# Altium schematic sheet ConnectorsCircuit.SchDoc
size A4
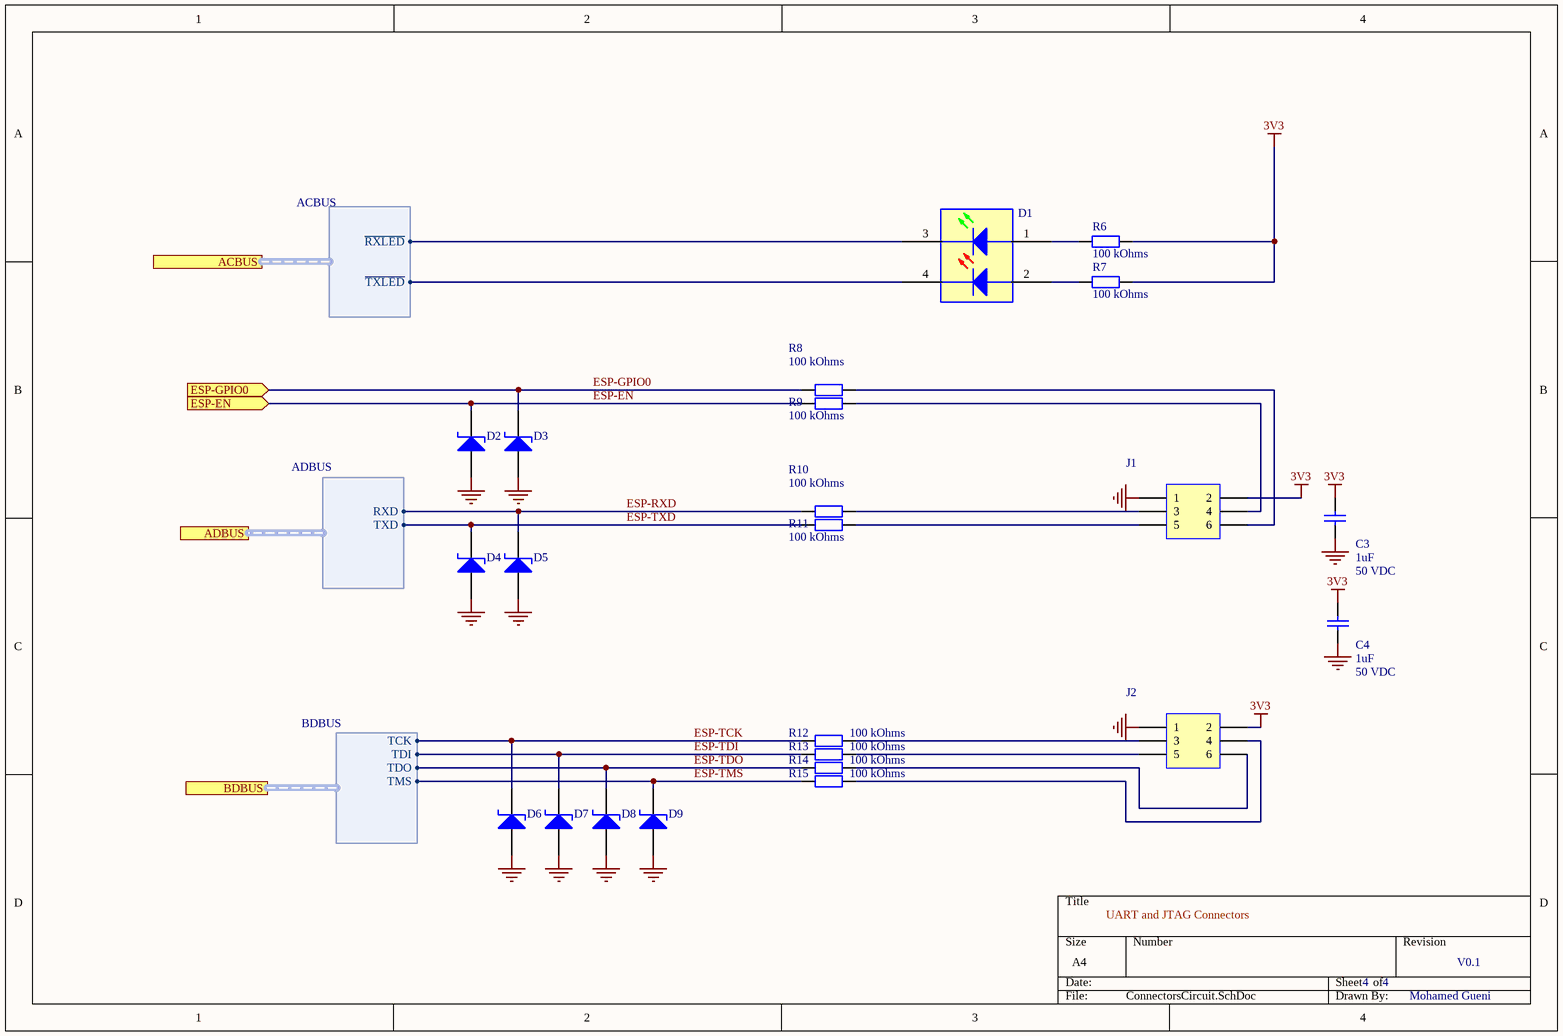
[diagram p0: ConnectorsCircuit.SchDoc]

## Parts
C3  Value 1: 1uF  Value 2: 50 VDC  [CAP-0603]  (hidden comment: Capacitor)
C4  Value 1: 1uF  Value 2: 50 VDC  [CAP-0603]  (hidden comment: Capacitor)
D1  LTST-C155KGJRKT  [LTSTC155KGJRKT]  (value not drawn)
D2  ESD7351HT1G  [SOD-323-2]  (value not drawn)
D3  ESD7351HT1G  [SOD-323-2]  (value not drawn)
D4  ESD7351HT1G  [SOD-323-2]  (value not drawn)
D5  ESD7351HT1G  [SOD-323-2]  (value not drawn)
D6  ESD7351HT1G  [SOD-323-2]  (value not drawn)
D7  ESD7351HT1G  [SOD-323-2]  (value not drawn)
D8  ESD7351HT1G  [SOD-323-2]  (value not drawn)
D9  ESD7351HT1G  [SOD-323-2]  (value not drawn)
J1  Header 3X2  [SHDR6W75P200_2X3_865X640X650P]  (value not drawn)
J2  Header 3X2  [SHDR6W75P200_2X3_865X640X650P]  (value not drawn)
R6  Value 1: 100 kOhms  [R0603]  (hidden comment: Resistor)
R7  Value 1: 100 kOhms  [R0603]  (hidden comment: Resistor)
R8  Value 1: 100 kOhms  [R0603]  (hidden comment: Resistor)
R9  Value 1: 100 kOhms  [R0603]  (hidden comment: Resistor)
R10  Value 1: 100 kOhms  [R0603]  (hidden comment: Resistor)
R11  Value 1: 100 kOhms  [R0603]  (hidden comment: Resistor)
R12  Value 1: 100 kOhms  [R0603]  (hidden comment: Resistor)
R13  Value 1: 100 kOhms  [R0603]  (hidden comment: Resistor)
R14  Value 1: 100 kOhms  [R0603]  (hidden comment: Resistor)
R15  Value 1: 100 kOhms  [R0603]  (hidden comment: Resistor)

## Ports
ACBUS (harness ACBUS), ADBUS (harness ADBUS), BDBUS (harness BDBUS), ESP-EN (in), ESP-GPIO0 (in)

## Harnesses
ADBUS: RXD, TXD
ACBUS: ~{RXLED}, ~{TXLED}
BDBUS: TCK, TDI, TDO, TMS

## Nets
3V3: C3.2 C4.2 J1.2 J2.2 R6.2 R7.2
GND: C3.1 C4.1 D2.1 D3.1 D4.1 D5.1 D6.1 D7.1 D8.1 D9.1 J1.1 J2.1
ESP-EN: D2.2(K1A2) R9.1 ; port ESP-EN
ESP-GPIO0: D3.2(K1A2) R8.1 ; port ESP-GPIO0
ESP-RXD: D5.2(K1A2) R10.1 ; port ADBUS.RXD
ESP-TCK: D6.2(K1A2) R12.1 ; port BDBUS.TCK
ESP-TDI: D7.2(K1A2) R13.1 ; port BDBUS.TDI
ESP-TDO: D8.2(K1A2) R14.1 ; port BDBUS.TDO
ESP-TMS: D9.2(K1A2) R15.1 ; port BDBUS.TMS
ESP-TXD: D4.2(K1A2) R11.1 ; port ADBUS.TXD
NetD1_1: D1.1 R6.1
NetD1_2: D1.2 R7.1
NetD1_3: D1.3 ; port ACBUS.~{RXLED}
NetD1_4: D1.4 ; port ACBUS.~{TXLED}
NetJ1_3: J1.3 R10.2
NetJ1_4: J1.4 R9.2
NetJ1_5: J1.5 R11.2
NetJ1_6: J1.6 R8.2
NetJ2_3: J2.3 R12.2
NetJ2_4: J2.4 R15.2
NetJ2_5: J2.5 R13.2
NetJ2_6: J2.6 R14.2

## Notes on the sheet
- UART and JTAG Connectors
- 4
- V0.1
- Mohamed Gueni

## Library data of the parts
C3 C4 = C-000000011: DES: Multilayer Ceramic Capacitors MLCC - SMD/SMT Automotive Grade,MLCC,0603,X7R,50V,1uF,+/-10%,0.8mm; MAN: TDK; MANREF: CGA3E3X7R1H105K080AB; SUP: Mouser; SUPREF: 810-CGA3E3X7R1H105K0; TOL: 10%; FTP: 0603; NOTE: _; Part Number: C-000000011
D1 = LED-000000001: DES: Standard LEDs - SMD Green/Red Clear; MAN: Lite-On; SUP: Mouser; SUPREF: 859-LTST-C155KGJRKT; Value 1: 20 mA; Value 2: 2 V; N°: LED-000000001; MANREF: LTST-C155KGJRKT; Footprint: 1311 (3227 metric); DataSheet: https://eu.mouser.com/datasheet/2/239/LTST-C155KGJRKT-1141409.pdf
D2-D9 = D-000000004: MAN: onsemi; DES: ESD Protection Diodes / TVS Diodes UNIDIRECTIONAL 3.3V ESD PR; Value 1: 5 V; Value 2: 3 A; TOL: _; SUP: Mouser; SUPREF: 863-ESD7351HT1G; Part Number: D-000000004; MANREF: ESD7351HT1G; FTP: SOD-323-2; NOTE: _; TOL1: _
J1 J2 = J-000000001: DES: 87833-0620; MAN: Headers & Wire Housings MGrid Hdr Shrd Vt W/ t W/Lck .76AuLF 6Ckt; MANREF: Molex / Molex; SUP: Mouser; SUPREF: 538-87833-0620; FTP: THT; NOTE: _; Part Number: J-000000001
R6-R15 = R-000000002: TOL: 1 %; DES: Thick Film Resistors - SMD 1/10watt 100Kohms 1%; MAN: Vishay; MANREF: CRCW0603100KFKEA; SUP: Mouser; SUPREF: 71-CRCW0603-100K-E3; Value 2: 100 mW; Part Number: R-000000002; FTP: R0603; NOTE: -